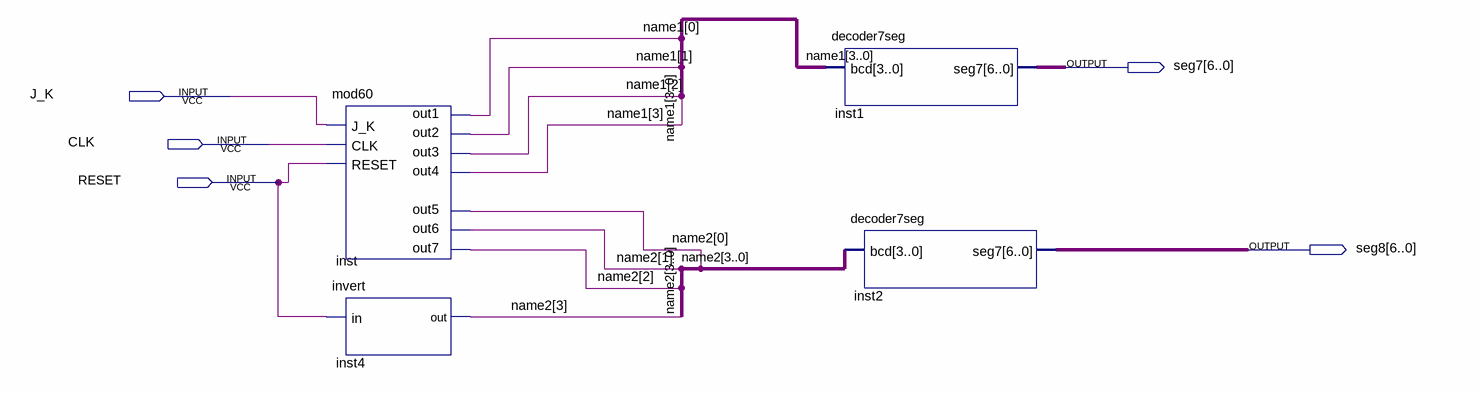
[diagram p0: schematic sheet]
// Quartus schematic test60.bdf as structural Verilog: 4 symbols, 5 pins
module test60 (
  input  J_K,
  input  CLK,
  input  RESET,
  output [6:0] seg7,
  output [6:0] seg8
);

  wire [3:0] name1, name2;

  mod60 inst (
    .J_K(J_K), .CLK(CLK), .RESET(RESET), .out5(name2[0]), .out4(name1[3]), .out6(name2[1]), .out1(name1[0]),
    .out7(name2[2]), .out2(name1[1]), .out3(name1[2]));
  invert inst4 (.in(RESET), .out(name2[3]));
  decoder7seg inst1 (.bcd(name1), .seg7(seg7));
  decoder7seg inst2 (.bcd(name2), .seg7(seg8));
endmodule
